# EAGLE schematic SecSysDem_HW (EAGLE 6.5.0)

## Sheet 1 of 6: Microcontroller
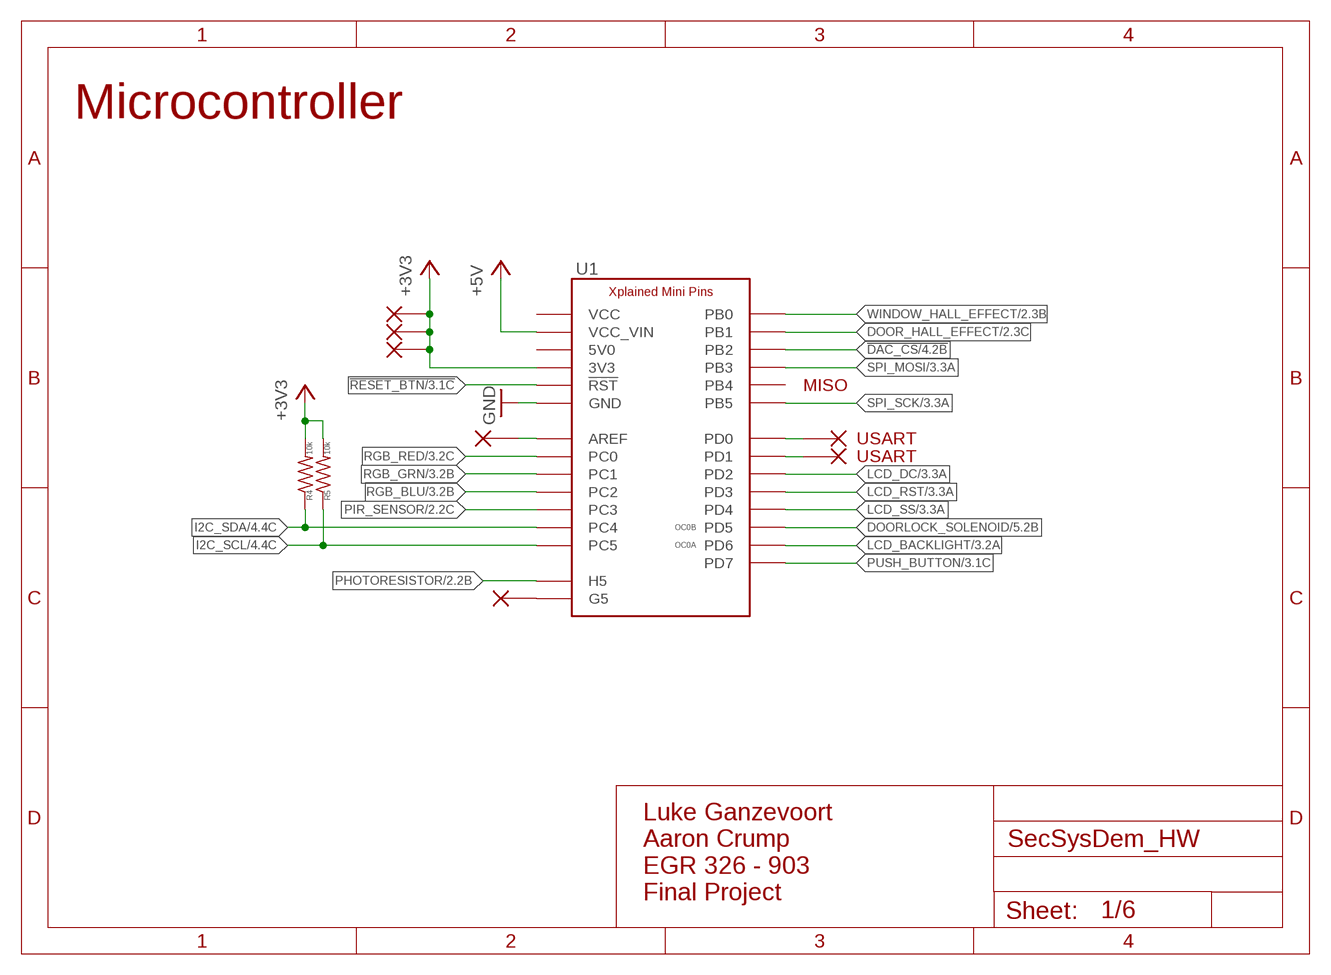
[diagram p0: schematic, sheet 1]

### Parts
R4  10k  RESISTOR0805  [C0805]
R5  10k  RESISTOR0805  [C0805]
U1  XPLAINED_MINI_PINOUT  [XPLAINED_MINI_PINS]
V3  TXD  VIA1  [VIA1]
V4  RXD  VIA1  [VIA1]
V5  G5  VIA1  [VIA1]
V6  AREF  VIA1  [VIA1]
V7  3v3  VIA1  [VIA1]
V8  3v3  VIA1  [VIA1]
V9  3v3  VIA1  [VIA1]

### Nets
!DAC_CS: U1.P$25(PB2) ; also sheet 4
!RESET_BTN: U1.P$12(!RST) ; also sheet 3
+3V3: R4.2 R5.2 U1.P$11(3V3) V7.P$1 V8.P$1 V9.P$1 ; also sheet 2,3,4
+5V: U1.P$7(VCC_VIN) ; also sheet 2,4,5,6
DOOR_HALL_EFFECT: U1.P$24(PB1) ; also sheet 2
DOORLOCK_SOLENOID: U1.P$20(PD5) ; also sheet 5
GND: U1.P$8(GND) U1.P$9(GND) U1.P$29(GND) ; also sheet 2,3,4,5,6
I2C_SCL: R5.1 U1.P$1(PC5) U1.P$32(PC5) ; also sheet 4
I2C_SDA: R4.1 U1.P$2(PC4) U1.P$31(PC4) ; also sheet 4
LCD_BACKLIGHT: U1.P$21(PD6) ; also sheet 3
LCD_DC: U1.P$17(PD2) ; also sheet 3
LCD_RST: U1.P$18(PD3) ; also sheet 3
LCD_SS: U1.P$19(PD4) ; also sheet 3
N$13: U1.P$15(PD0) V3.P$1
N$14: U1.P$16(PD1) V4.P$1
N$15: U1.P$34(G5) V5.P$1
N$16: U1.P$30(AREF) V6.P$1
PHOTORESISTOR: U1.P$33(H5) ; also sheet 2
PIR_SENSOR: U1.P$3(PC3) ; also sheet 2
PUSH_BUTTON: U1.P$22(PD7) ; also sheet 3
RGB_BLU: U1.P$4(PC2) ; also sheet 3
RGB_GRN: U1.P$5(PC1) ; also sheet 3
RGB_RED: U1.P$6(PC0) ; also sheet 3
SPI_MOSI: U1.P$26(PB3) ; also sheet 3,4
SPI_SCK: U1.P$28(PB5) ; also sheet 3,4
WINDOW_HALL_EFFECT: U1.P$23(PB0) ; also sheet 2
Unconnected: U1.P$10(5V0) U1.P$13(VCC) U1.P$27(PB4)

### Notes on the sheet
- Microcontroller
- MISO
- USART
- USART
- OC0B
- OC0A
- Luke Ganzevoort
  Aaron Crump
  EGR 326 - 903
  Final Project

## Sheet 2 of 6: Sensors
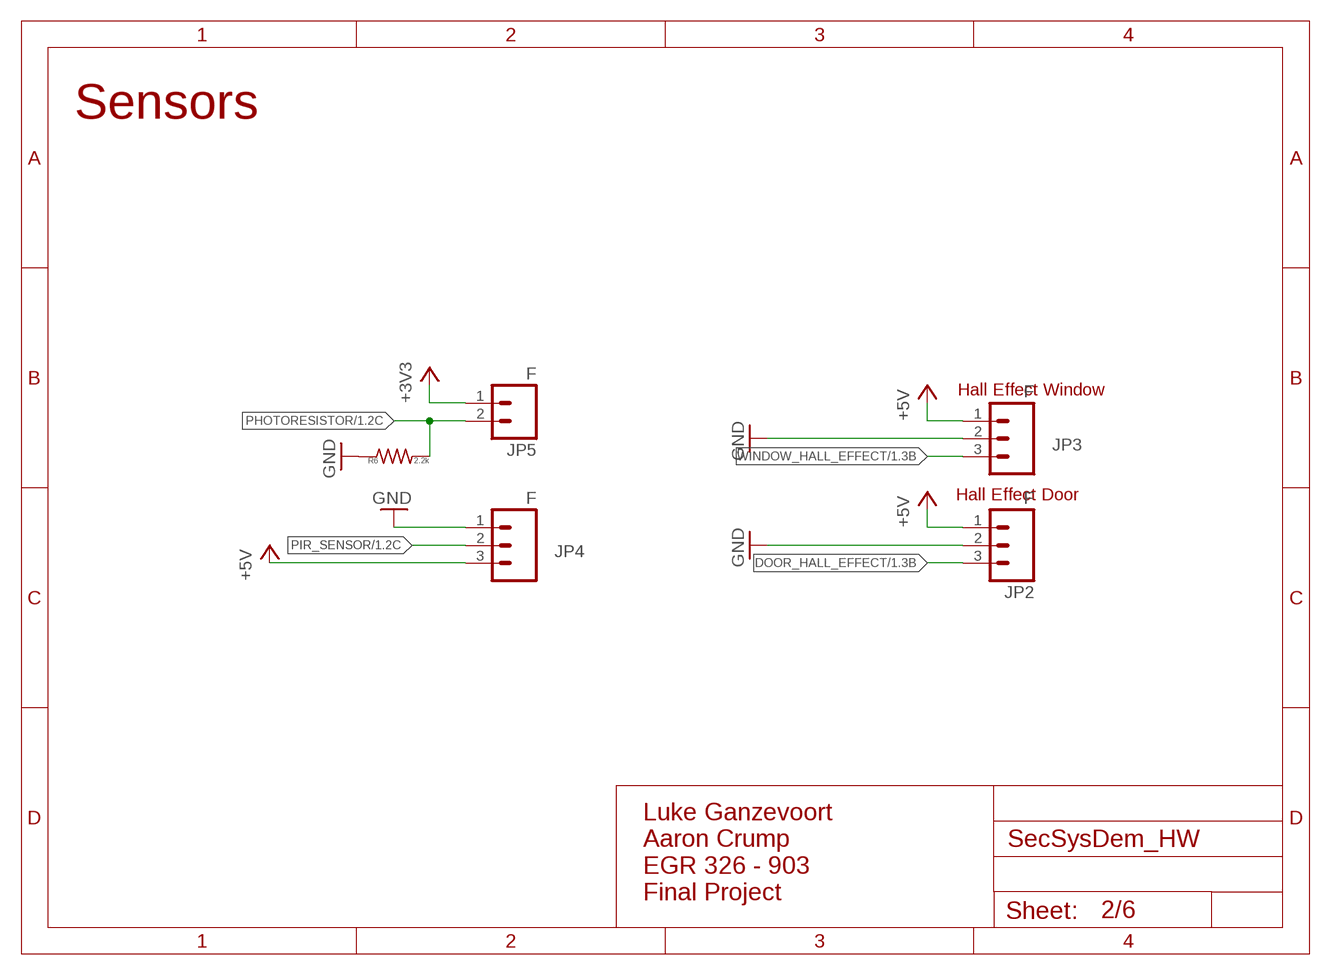
[diagram p1: schematic, sheet 2]

### Parts
JP2  F  M03PTH  [1X03]
JP3  F  M03PTH  [1X03]
JP4  F  M03PTH  [1X03]
JP5  F  M02PTH  [1X02]
R6  2.2k  RESISTOR0805  [C0805]

### Nets
+3V3: JP5.1 ; also sheet 1,3,4
+5V: JP2.1 JP3.1 JP4.3 ; also sheet 1,4,5,6
DOOR_HALL_EFFECT: JP2.3 ; also sheet 1
GND: JP2.2 JP3.2 JP4.1 R6.1 ; also sheet 1,3,4,5,6
PHOTORESISTOR: JP5.2 R6.2 ; also sheet 1
PIR_SENSOR: JP4.2 ; also sheet 1
WINDOW_HALL_EFFECT: JP3.3 ; also sheet 1

### Notes on the sheet
- Sensors
- Hall Effect Window
- Hall Effect Door
- Luke Ganzevoort
  Aaron Crump
  EGR 326 - 903
  Final Project

## Sheet 3 of 6: User Interface
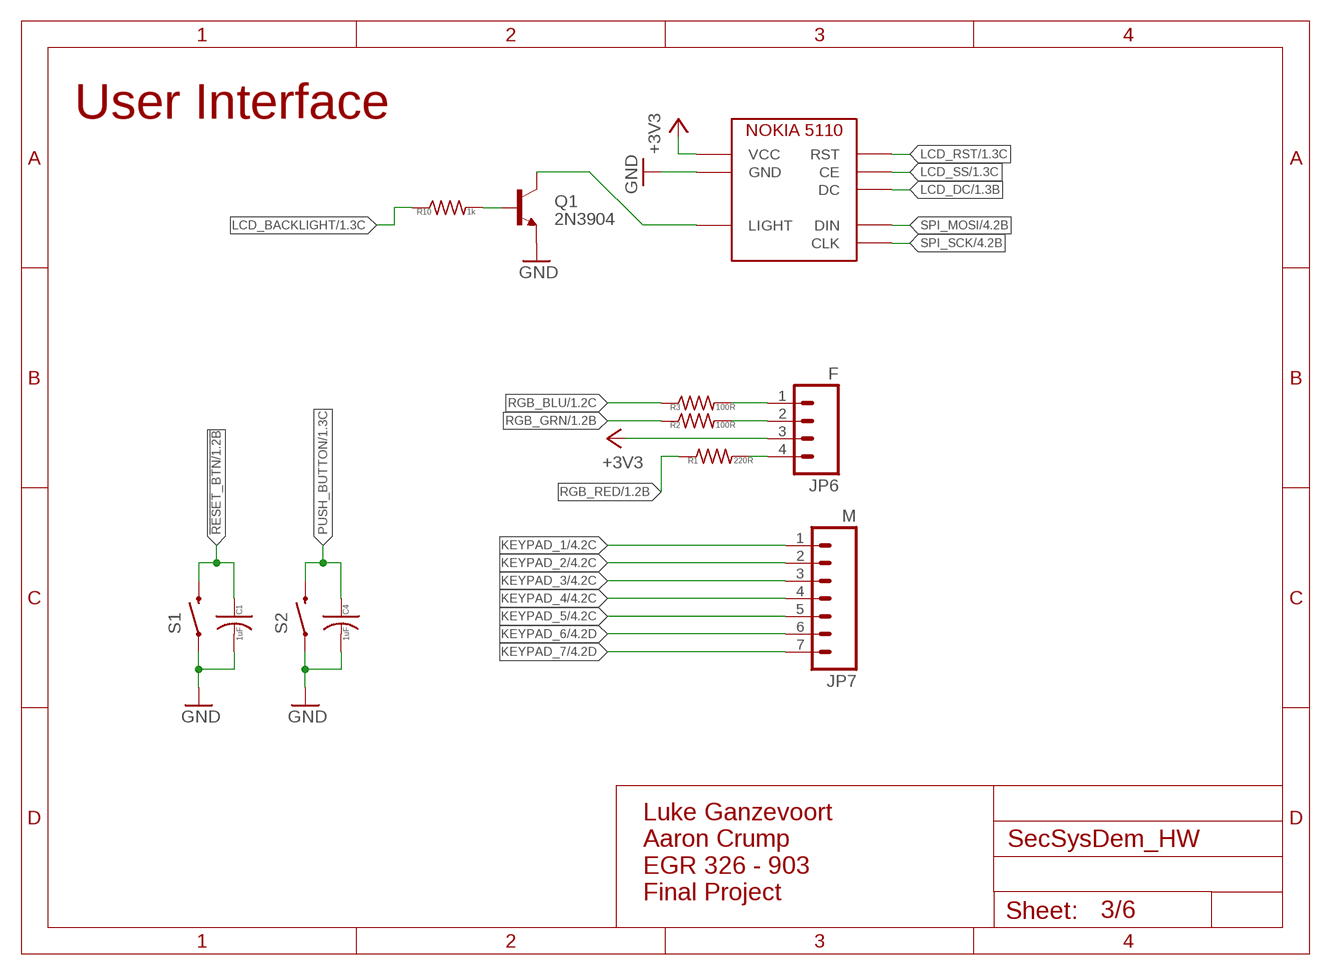
[diagram p2: schematic, sheet 3]

### Parts
C1  1uF  CAPACITOR0805  [C0805]
C4  1uF  CAPACITOR0805  [C0805]
JP6  F  M04PTH  [1X04]
JP7  M  M07  [1X07]
Q1  2N3904  TRANSISTOR_NPNBC547  [TO-92-AMMO]
R1  220R  RESISTOR0805  [C0805]
R2  100R  RESISTOR0805  [C0805]
R3  100R  RESISTOR0805  [C0805]
R10  1k  RESISTOR0805  [C0805]
S1  TACTILE_SWITCHTHROUGH_HOLE  [TACTILE_SWITCH]
S2  TACTILE_SWITCHTHROUGH_HOLE  [TACTILE_SWITCH]
U$3  NOKIA_5110_LCD  [NOKIA_5110]

### Nets
!RESET_BTN: C1.1(POS) S1.3 S1.4 ; also sheet 1
+3V3: JP6.3 U$3.P$6(VCC) U$3.P$14(VCC) ; also sheet 1,2,4
GND: C1.2(NEG) C4.2(NEG) Q1.3(E) S1.1 S1.2 S2.1 S2.2 U$3.P$8(GND) U$3.P$16(GND) ; also sheet 1,2,4,5,6
KEYPAD_1: JP7.1 ; also sheet 4
KEYPAD_2: JP7.2 ; also sheet 4
KEYPAD_3: JP7.3 ; also sheet 4
KEYPAD_4: JP7.4 ; also sheet 4
KEYPAD_5: JP7.5 ; also sheet 4
KEYPAD_6: JP7.6 ; also sheet 4
KEYPAD_7: JP7.7 ; also sheet 4
LCD_BACKLIGHT: R10.1 ; also sheet 1
LCD_DC: U$3.P$3(DC) U$3.P$11(DC) ; also sheet 1
LCD_RST: U$3.P$1(RST) U$3.P$9(RST) ; also sheet 1
LCD_SS: U$3.P$2(CE) U$3.P$10(CE) ; also sheet 1
N$2: JP6.4 R1.2
N$4: JP6.2 R2.2
N$5: JP6.1 R3.2
N$7: Q1.2(B) R10.2
N$18: Q1.1(C) U$3.P$7(LIGHT) U$3.P$15(LIGHT)
PUSH_BUTTON: C4.1(POS) S2.3 S2.4 ; also sheet 1
RGB_BLU: R3.1 ; also sheet 1
RGB_GRN: R2.1 ; also sheet 1
RGB_RED: R1.1 ; also sheet 1
SPI_MOSI: U$3.P$4(DIN) U$3.P$12(DIN) ; also sheet 1,4
SPI_SCK: U$3.P$5(CLK) U$3.P$13(CLK) ; also sheet 1,4

### Notes on the sheet
- User Interface
- Luke Ganzevoort
  Aaron Crump
  EGR 326 - 903
  Final Project

## Sheet 4 of 6: Other SPI & I2C
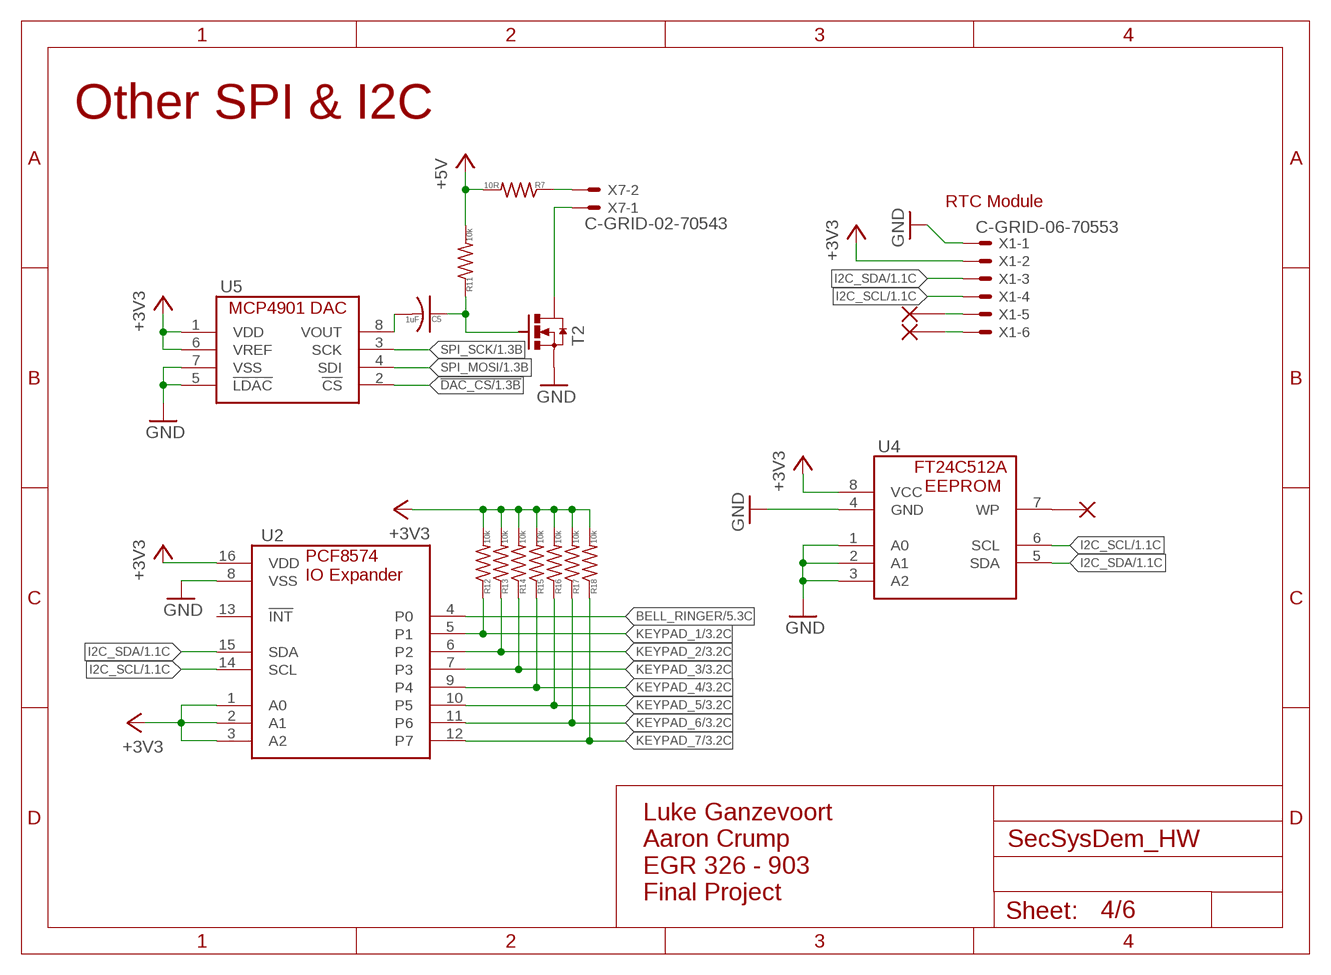
[diagram p3: schematic, sheet 4]

### Parts
C5  1uF  CAPACITOR0805  [C0805]
R7  10R  RESISTOR0805  [C0805]
R11  10k  RESISTOR0805  [C0805]
R12  10k  RESISTOR0805  [C0805]
R13  10k  RESISTOR0805  [C0805]
R14  10k  RESISTOR0805  [C0805]
R15  10k  RESISTOR0805  [C0805]
R16  10k  RESISTOR0805  [C0805]
R17  10k  RESISTOR0805  [C0805]
R18  10k  RESISTOR0805  [C0805]
T2  MOSFET_NCHANNEL_ENHANCEMENT2N7002,215  [SOT23]
U2  PCF8574_IO_EXPANDER  [DIL16]
U4  FT24C512A  [8-SOIC]
U5  MCP4901-E/SN  [8-SOIC]
V1  WP  VIA1  [VIA1]
V2  32k  VIA1  [VIA1]
V10  SQW  VIA1  [VIA1]
X1  C-GRID-06-70553  [70553-06]
X7  C-GRID-02-70543  [70543-02]

### Nets
!DAC_CS: U5.2(!CS) ; also sheet 1
+3V3: R12.2 R13.2 R14.2 R15.2 R16.2 R17.2 R18.2 U2.1(A0) U2.2(A1) U2.3(A2) U2.16(VDD) U4.8(VCC) U5.1(VDD) U5.6(VREF) X1.2 ; also sheet 1,2,3
+5V: R7.2 R11.2 ; also sheet 1,2,5,6
BELL_RINGER: U2.4(P0) ; also sheet 5
GND: T2.2(S) U2.8(VSS) U4.1(A0) U4.2(A1) U4.3(A2) U4.4(GND) U5.5(!LDAC) U5.7(VSS) X1.1 ; also sheet 1,2,3,5,6
I2C_SCL: U2.14(SCL) U4.6(SCL) X1.4 ; also sheet 1
I2C_SDA: U2.15(SDA) U4.5(SDA) X1.3 ; also sheet 1
KEYPAD_1: R12.1 U2.5(P1) ; also sheet 3
KEYPAD_2: R13.1 U2.6(P2) ; also sheet 3
KEYPAD_3: R14.1 U2.7(P3) ; also sheet 3
KEYPAD_4: R15.1 U2.9(P4) ; also sheet 3
KEYPAD_5: R16.1 U2.10(P5) ; also sheet 3
KEYPAD_6: R17.1 U2.11(P6) ; also sheet 3
KEYPAD_7: R18.1 U2.12(P7) ; also sheet 3
N$3: C5.1(POS) R11.1 T2.1(G)
N$6: T2.3(D) X7.1
N$8: U4.7(WP) V1.P$1
N$11: R7.1 X7.2
N$12: V2.P$1 X1.6
N$19: C5.2(NEG) U5.8(VOUT)
N$20: V10.P$1 X1.5
SPI_MOSI: U5.4(SDI) ; also sheet 1,3
SPI_SCK: U5.3(SCK) ; also sheet 1,3
Unconnected: U2.13(!INT)

### Notes on the sheet
- Other SPI & I2C
- RTC Module
- Luke Ganzevoort
  Aaron Crump
  EGR 326 - 903
  Final Project

## Sheet 5 of 6: Solenoid Drivers
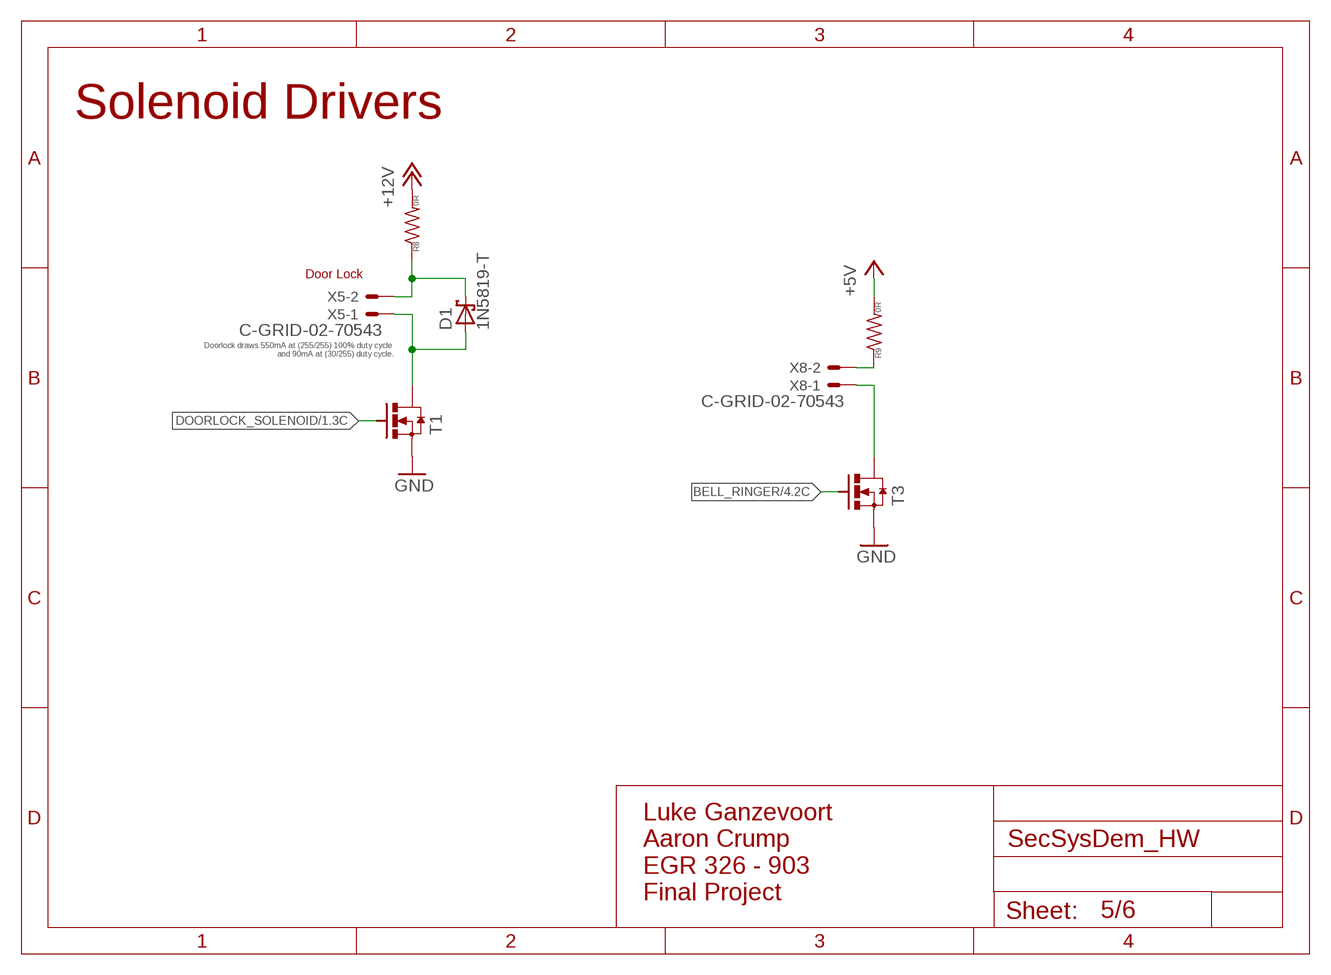
[diagram p4: schematic, sheet 5]

### Parts
D1  1N5819-T  [DO41-7.6]
R8  0R  RESISTOR0805  [C0805]
R9  0R  RESISTOR0805  [C0805]
T1  MOSFET_NCHANNEL_ENHANCEMENT2N7002,215  [SOT23]
T3  MOSFET_NCHANNEL_ENHANCEMENT2N7002,215  [SOT23]
X5  C-GRID-02-70543  [70543-02]
X8  C-GRID-02-70543  [70543-02]

### Nets
+5V: R9.2 ; also sheet 1,2,4,6
+12V: R8.2 ; also sheet 6
BELL_RINGER: T3.1(G) ; also sheet 4
DOORLOCK_SOLENOID: T1.1(G) ; also sheet 1
GND: T1.2(S) T3.2(S) ; also sheet 1,2,3,4,6
N$1: D1.A T1.3(D) X5.1
N$9: R9.1 X8.2
N$10: T3.3(D) X8.1
N$17: D1.C R8.1 X5.2

### Notes on the sheet
- Solenoid Drivers
- Door Lock
- Doorlock draws 550mA at (255/255) 100% duty cycle 
  and 90mA at (30/255) duty cycle.
- Luke Ganzevoort
  Aaron Crump
  EGR 326 - 903
  Final Project

## Sheet 6 of 6: Power
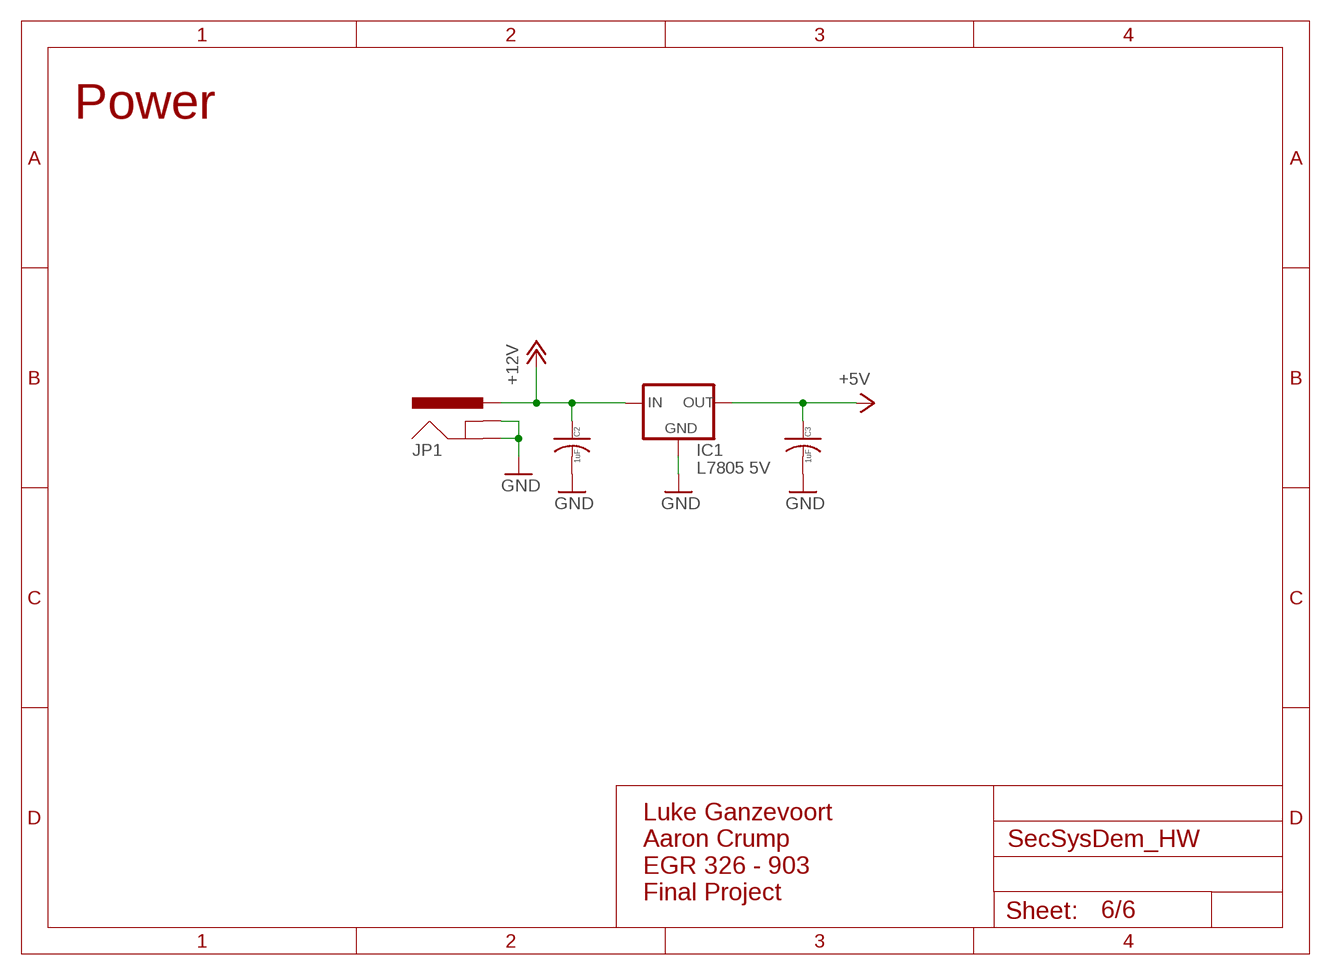
[diagram p5: schematic, sheet 6]

### Parts
C2  1uF  CAPACITOR0805  [C0805]
C3  1uF  CAPACITOR0805  [C0805]
IC1  L7805 5V  78XXL  [78XXL]
JP1  POWER_JACKPTH_BREAD  [POWER_JACK_PTH_BREAD]

### Nets
+5V: C3.1(POS) IC1.OUT ; also sheet 1,2,4,5
+12V: C2.1(POS) IC1.IN JP1.PWR ; also sheet 5
GND: C2.2(NEG) C3.2(NEG) IC1.GND JP1.GND JP1.GNDBREAK ; also sheet 1,2,3,4,5

### Notes on the sheet
- Power
- Luke Ganzevoort
  Aaron Crump
  EGR 326 - 903
  Final Project

## Library data of the parts
C1-C5 = Luke:CAPACITOR
D1 = diode:1N581*: 1.0A SCHOTTKY BARRIER RECTIFIER Source: http://www.diodes.com/datasheets/ds23001.pdf
IC1 = v-reg:78XXL: VOLTAGE REGULATOR
JP1 = SparkFun-Connectors:POWER_JACK: Power Jack This is the standard 5.5mm barrel jack for power. The PTH is the most common, proven, reliable, footprint. The Slot footprint only works if the mill layer is transmitted to the PCB fab house so be warned. Mating wall wart : TOL-00298 (and others); PROD_ID: PRT-10811
JP2-JP4 = SparkFun-Connectors:M03: Header 3 Standard 3-pin 0.1" header. Use with straight break away headers (SKU : PRT-00116), right angle break away headers (PRT-00553), swiss pins (PRT-00743), machine pins (PRT-00117), and female headers (PRT-00115). Molex polarized connector foot print use with SKU : PRT-08232 with associated crimp pins and housings.
JP5 = SparkFun-Connectors:M02: Standard 2-pin 0.1" header. Use with - straight break away headers ( PRT-00116) - right angle break away headers (PRT-00553) - swiss pins (PRT-00743) - machine pins (PRT-00117) - female headers (PRT-00115) Molex polarized connector foot print use with: PRT-08233 with associated crimp pins and housings. 2.54_SCREWTERM for use with PRT-10571. 3.5mm Screw Terminal footprints for PRT-08084 5mm Screw Terminal footprints for use with PRT-08432
JP6 = SparkFun-Connectors:M04: Header 4 Standard 4-pin 0.1" header. Use with straight break away headers (SKU : PRT-00116), right angle break away headers (PRT-00553), swiss pins (PRT-00743), machine pins (PRT-00117), and female headers (PRT-00115). Molex polarized connector foot print use with SKU : PRT-08231 with associated crimp pins and housings. 1MM SMD Version SKU: PRT-10208
JP7 = SparkFun-Connectors:M07: Header 7 Standard 7-pin 0.1" header. Use with straight break away headers (SKU : PRT-00116), right angle break away headers (PRT-00553), swiss pins (PRT-00743), machine pins (PRT-00117), and female headers (PRT-00115). NOTES ON THE VARIANTS LOCK and LOCK_LONGPADS... This footprint was designed to help hold the alignment of a through-hole component (i.e. 7-pin header) while soldering it into place. You may notice that each hole has been shifted either up or down by 0.005 of an inch from it's more standard position (which is usually a perfectly straight line). This slight alteration caused the pins (the squares in the middle) to touch the edges of the holes. Because they are alternating, it causes a "brace" to hold the header in place. 0.005 has proven to be the perfect amount of "off-center" position when using our standard breakaway headers. Although looks a little odd when you look at the bare footprint, once you have a header in there, the alteration is very hard to notice. Also, if you push a header all the way into place, it is covered up entirely on the bottom side. This idea of altering the position of holes to aid alignment will be further integrated into the Sparkfun Library for other footprints. It can help hold any component with 3 or more connection pins.
Q1 = SparkFun-DiscreteSemi:TRANSISTOR_NPN: Generic NPN BJT MMBT2222A - TRANS-08049 (SOT-23, 1A 40V) MPSA42 - TRANS-09116 (SOT-23, 500mA 300V) MMBT5088LT1G - TRANS-11160 (SOT-23, 50 mA 30V) BC547 - COM-08928 <http://www.sparkfun.com/products/8928> (TO-92 45V 100mA) (1.Collector 2.Base 3.Emitter) 2N3904 - COM-00521 <http://www.sparkfun.com/products/521> (TO-92 40V 200mA) (1.Emitter 2.Base 3.Collector) P2N2222A - COM-12852 <http://www.sparkfun.com/products/12852> (TO-92 40V 600mA) (1.Collector 2.Base 3.Emitter)
R1-R18 = Luke:RESISTOR
S1 S2 = Luke:TACTILE_SWITCH
T1-T3 = Luke:MOSFET_NCHANNEL_ENHANCEMENT; ID: 300 mA; POWER: 830 mW; VDS: 60 V; VGS: 2 V
U1 = Luke:XPLAINED_MINI_PINOUT
U2 = Luke:PCF8574_IO_EXPANDER
U4 = Luke:FT24C512A
U5 = Luke:MCP4901
U$3 = Luke:NOKIA_5110_LCD
V1-V10 = Luke:VIA1
X1 = con-molex:C-GRID-06: CONNECTOR wire to board 2.54 mm (0.100") pitch header; OC_FARNELL: unknown; OC_NEWARK: unknown
X5 X7 X8 = con-molex:C-GRID-02: CONNECTOR wire to board 2.54 mm (0.100") pitch header; OC_FARNELL: unknown; OC_NEWARK: unknown